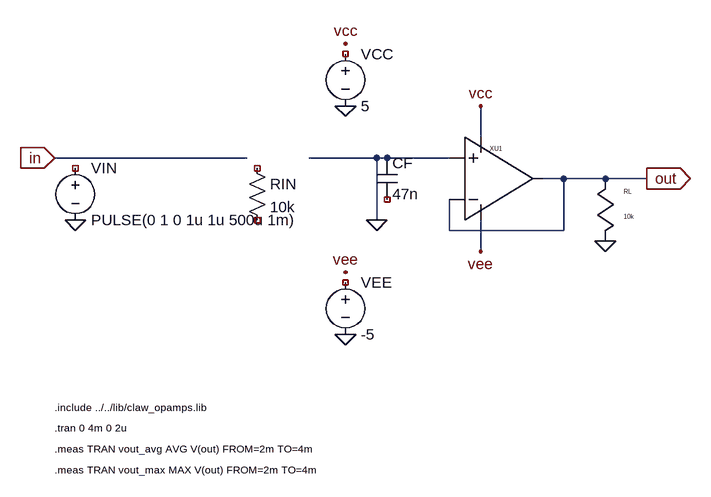
[diagram p0: schematic opamp_active_lowpass.asc]
opamp_active_lowpass.asc, the LTspice schematic file:
Version 4
SHEET 1 1200 887
WIRE 64 224 360 224
WIRE 456 224 672 224
WIRE 560 224 560 320
WIRE 816 256 976 256
WIRE 816 256 848 256
WIRE 848 256 848 336
WIRE 848 336 672 336
WIRE 672 336 672 288
WIRE 720 192 720 144
WIRE 720 320 720 368
SYMBOL voltage 96 224 R0
SYMATTR InstName VIN
SYMATTR Value PULSE(0 1 0 1u 1u 500u 1m)
SYMBOL voltage 512 48 R0
SYMATTR InstName VCC
SYMATTR Value 5
SYMBOL voltage 512 400 R0
SYMATTR InstName VEE
SYMATTR Value -5
SYMBOL res 360 224 R0
SYMATTR InstName RIN
SYMATTR Value 10k
SYMBOL cap 560 224 R0
SYMATTR InstName CF
SYMATTR Value 47n
SYMBOL opamp2 672 192 R0
SYMATTR InstName XU1
SYMATTR Value CLAW_IDEAL_OPAMP
SYMBOL res_v 912 256 R0
SYMATTR InstName RL
SYMATTR Value 10k
FLAG 64 224 in
IOPIN 64 224 In
FLAG 976 256 out
IOPIN 976 256 Out
FLAG 96 320 0
FLAG 560 320 0
FLAG 912 352 0
FLAG 512 48 vcc
FLAG 512 144 0
FLAG 512 400 vee
FLAG 512 496 0
FLAG 720 144 vcc
FLAG 720 368 vee
TEXT 64 608 Left 1 !.include ../../lib/claw_opamps.lib
TEXT 64 640 Left 1 !.tran 0 4m 0 2u
TEXT 64 672 Left 1 !.meas TRAN vout_avg AVG V(out) FROM=2m TO=4m
TEXT 64 704 Left 1 !.meas TRAN vout_max MAX V(out) FROM=2m TO=4m

The netlist it stands for:
* opamp_active_lowpass.asc
VIN NC_01 0 PULSE(0 1 0 1u 1u 500u 1m)
VCC NC_02 0 5
VEE NC_03 0 -5
RIN NC_04 NC_05 10k
CF 0 NC_06 47n
XXU1 CLAW_IDEAL_OPAMP CLAW_IDEAL_OPAMP
RL out 0 10k
.include ../../lib/claw_opamps.lib
.tran 0 4m 0 2u
.meas TRAN vout_avg AVG V(out) FROM=2m TO=4m
.meas TRAN vout_max MAX V(out) FROM=2m TO=4m
.backanno
.end